# EAGLE design Shruthi-Digital-v02 (EAGLE 5.09)
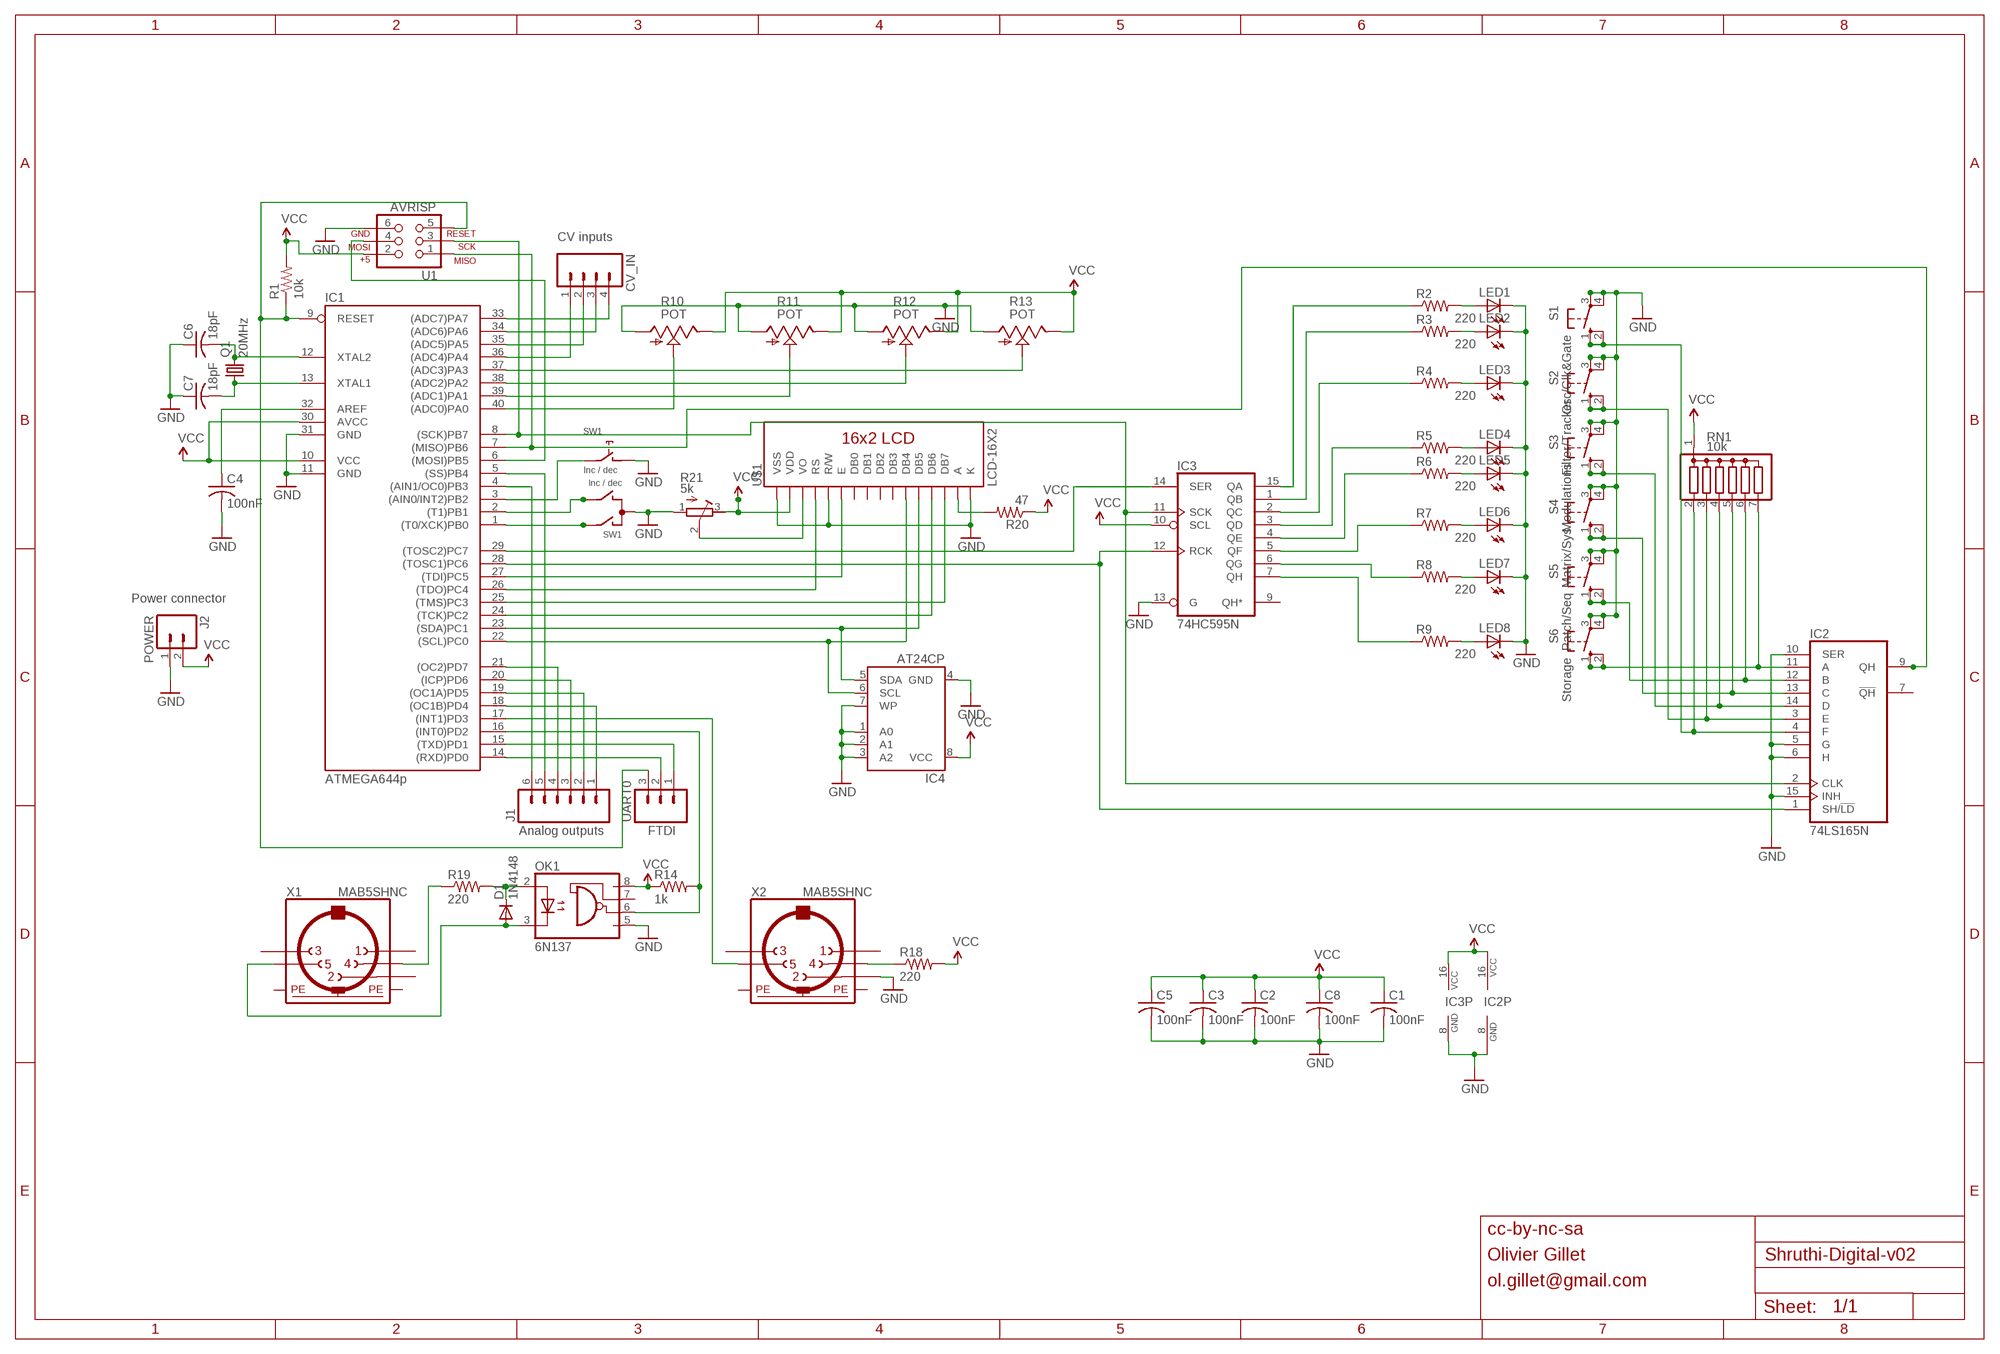
[diagram p0: schematic, sheet 1]

## Parts
C1  100nF  C-US025-024X044  [C025-024X044]
C2  100nF  C-US025-024X044  [C025-024X044]
C3  100nF  C-US025-024X044  [C025-024X044]
C4  100nF  C-US025-024X044  [C025-024X044]
C5  100nF  C-US025-024X044  [C025-024X044]
C6  18pF  C-US025-024X044  [C025-024X044]
C7  18pF  C-US025-024X044  [C025-024X044]
C8  100nF  C-US025-024X044  [C025-024X044]
CV_IN  M04PTH  [1X04]
D1  1N4148  DIODE-D-5  [D-5]
IC1  ATMEGA644p  MEGA16-P  [DIL40]
IC2  74LS165N  [DIL16]
IC3  74HC595N  [DIL16]
IC4  AT24CP  [DIL08]
J1  M06SIP  [1X06]
J2  POWER  M02PTH  [1X02]
LED1  LED3MM  [LED3MM]
LED2  LED3MM  [LED3MM]
LED3  LED3MM  [LED3MM]
LED4  LED3MM  [LED3MM]
LED5  LED3MM  [LED3MM]
LED6  LED3MM  [LED3MM]
LED7  LED3MM  [LED3MM]
LED8  LED3MM  [LED3MM]
OK1  6N137  [DIL08]
Q1  20MHz  CRYSTALHC49U-V  [HC49U-V]
R1  10k  R-US_0204/7  [0204/7]
R2  220  R-US_0204/7  [0204/7]
R3  220  R-US_0204/7  [0204/7]
R4  220  R-US_0204/7  [0204/7]
R5  220  R-US_0204/7  [0204/7]
R6  220  R-US_0204/7  [0204/7]
R7  220  R-US_0204/7  [0204/7]
R8  220  R-US_0204/7  [0204/7]
R9  220  R-US_0204/7  [0204/7]
R10  POT  POT_US  [ALPS_POT_SFE]
R11  POT  POT_US  [ALPS_POT_SFE]
R12  POT  POT_US  [ALPS_POT_SFE]
R13  POT  POT_US  [ALPS_POT_SFE]
R14  1k  R-US_0204/7  [0204/7]
R18  220  R-US_0204/7  [0204/7]
R19  220  R-US_0204/7  [0204/7]
R20  47  R-US_0204/7  [0204/7]
R21  5k  R-TRIMM3296W  [RTRIM3296W]
RN1  10k  G06R  [SIL7]
S1  Osc/Clk&Gate  40-XX  [B3F-40XX]
S2  Filter/Tracker  40-XX  [B3F-40XX]
S3  Modulations  40-XX  [B3F-40XX]
S4  Matrix/Sys  40-XX  [B3F-40XX]
S5  Patch/Seq  40-XX  [B3F-40XX]
S6  Storage  40-XX  [B3F-40XX]
SW1  Inc / dec  EC12E_SW  [ALPS_EC12E_SW]
U1  AVRISP  AVR_SPI_PRG_6PTH  [2X3]
U$1  LCD-16X2  [LCD-16X2]
UART0  M03PTH  [1X03]
X1  MAB5SHNC  [MAB5SH-NC]
X2  MAB5SHNC  [MAB5SH-NC]

## Nets
GND: C1.2 C2.2 C3.2 C4.2 C5.2 C6.1 C7.1 C8.2 IC1.11(GND) IC1.31(GND) IC2.5(G) IC2.6(H) IC2.8(GND) IC2.10(SER) IC2.15(INH) IC3.8(GND) IC3.13(G) IC4.1(A0) IC4.2(A1) IC4.3(A2) IC4.4(GND) IC4.7(WP) J2.1 LED1.K(C) LED2.K(C) LED3.K(C) LED4.K(C) LED5.K(C) LED6.K(C) LED7.K(C) LED8.K(C) OK1.5(GND) R10.P$3(A) R11.P$3(A) R12.P$3(A) R13.P$3(A) R21.1(E) S1.3(P) S1.4(P1) S2.3(P) S2.4(P1) S3.3(P) S3.4(P1) S4.3(P) S4.4(P1) S5.3(P) S5.4(P1) S6.3(P) S6.4(P1) SW1.C SW1.D U1.6 U$1.1(VSS) U$1.5(R/W) U$1.16(K) X2.2
N$1: IC3.2(QC) R4.1
N$2: IC1.14((RXD)PD0) UART0.2
N$3: IC2.11(A) RN1.7 S6.1(S) S6.2(S1)
N$5: IC2.3(E) RN1.3 S2.1(S) S2.2(S1)
N$6: IC1.9(RESET) R1.1 U1.5 UART0.3
N$7: C4.1 IC1.32(AREF)
N$8: IC1.8((SCK)PB7) IC2.2(CLK) IC3.11(SCK) U1.3
N$9: IC1.7((MISO)PB6) IC2.9(QH) U1.1
N$10: CV_IN.1 IC1.36((ADC4)PA4)
N$11: CV_IN.2 IC1.35((ADC5)PA5)
N$12: CV_IN.3 IC1.34((ADC6)PA6)
N$13: CV_IN.4 IC1.33((ADC7)PA7)
N$14: IC1.40((ADC0)PA0) R10.P$2(S)
N$15: IC1.39((ADC1)PA1) R11.P$2(S)
N$16: IC1.38((ADC2)PA2) R12.P$2(S)
N$17: IC1.37((ADC3)PA3) R13.P$2(S)
N$18: IC1.4((AIN1/OC0)PB3) J1.6
N$19: IC1.5((SS)PB4) J1.5
N$20: IC1.18((OC1B)PD4) J1.1
N$21: IC1.19((OC1A)PD5) J1.2
N$22: IC1.20((ICP)PD6) J1.3
N$23: IC1.21((OC2)PD7) J1.4
N$25: IC1.15((TXD)PD1) UART0.1
N$26: IC1.22((SCL)PC0) IC4.6(SCL) U$1.11(DB4)
N$27: IC1.26((TDO)PC4) U$1.4(RS)
N$28: D1.C OK1.2(A) R19.2
N$29: IC1.28((TOSC1)PC6) IC2.1(SH/!LD) IC3.12(RCK)
N$30: IC3.15(QA) R2.1
N$31: IC3.1(QB) R3.1
N$33: IC3.3(QD) R5.1
N$34: IC3.4(QE) R6.1
N$35: IC3.5(QF) R7.1
N$36: IC3.7(QH) R9.1
N$37: IC3.6(QG) R8.1
N$42: LED1.A R2.2
N$43: LED2.A R3.2
N$44: LED3.A R4.2
N$45: LED4.A R5.2
N$46: LED5.A R6.2
N$47: LED6.A R7.2
N$48: LED7.A R8.2
N$49: LED8.A R9.2
N$57: IC1.6((MOSI)PB5) U1.4
N$58: IC1.29((TOSC2)PC7) IC3.14(SER)
N$59: IC2.4(F) RN1.2 S1.1(S) S1.2(S1)
N$61: IC2.14(D) RN1.4 S3.1(S) S3.2(S1)
N$62: IC2.13(C) RN1.5 S4.1(S) S4.2(S1)
N$63: IC2.12(B) RN1.6 S5.1(S) S5.2(S1)
N$64: IC1.1((T0/XCK)PB0) SW1.A
N$65: IC1.2((T1)PB1) SW1.B
N$66: IC1.3((AIN0/INT2)PB2) SW1.E
N$68: R18.1 X2.4
N$69: IC1.17((INT1)PD3) X2.5
N$70: IC1.16((INT0)PD2) OK1.6(VO) R14.2
N$71: IC1.23((SDA)PC1) IC4.5(SDA) U$1.12(DB5)
N$72: R19.1 X1.4
N$73: D1.A OK1.3(C) X1.5
N$74: IC1.24((TCK)PC2) U$1.13(DB6)
N$75: IC1.25((TMS)PC3) U$1.14(DB7)
N$76: IC1.27((TDI)PC5) U$1.6(E)
N$78: R21.2(S) U$1.3(VO)
N$79: R20.2 U$1.15(A)
N$82: C7.2 IC1.13(XTAL1) Q1.1
N$83: C6.2 IC1.12(XTAL2) Q1.2
VCC: C1.1 C2.1 C3.1 C5.1 C8.1 IC1.10(VCC) IC1.30(AVCC) IC2.16(VCC) IC3.10(SCL) IC3.16(VCC) IC4.8(VCC) J2.2 OK1.8(VCC) R1.2 R10.P$1(E) R11.P$1(E) R12.P$1(E) R13.P$1(E) R14.1 R18.2 R20.1 R21.3(A) RN1.1 U1.2 U$1.2(VDD)
Unconnected: IC2.7(!QH) IC3.9(QH*) OK1.7(VE) SW1.GND1(G) SW1.GND2(G) U$1.7(DB0) U$1.8(DB1) U$1.9(DB2) U$1.10(DB3) X1.1 X1.2 X1.3 X2.1 X2.3

## Notes on the sheet
- CV inputs
- Power connector
- Analog outputs | FTDI
- cc-by-nc-sa
- Olivier Gillet
- ol.gillet@gmail.com

## Power pins joined to a net without a drawn wire
PE: X1.PE X1.PE@(PE) X2.PE X2.PE@(PE)

## Library data of the parts
C1-C8 = rcl:C-US: CAPACITOR, American symbol
CV_IN = SparkFun:M04: Header 4 Standard 4-pin 0.1" header. Use with straight break away headers (SKU : PRT-00116), right angle break away headers (PRT-00553), swiss pins (PRT-00743), machine pins (PRT-00117), and female headers (PRT-00115). Molex polarized connector foot print use with SKU : PRT-08231 with associated crimp pins and housings.
D1 = diode:DIODE-: DIODE
IC1 = atmel:MEGA16-P: MICROCONTROLLER 16 Kbytes FLASH 1 kbytes SRAM 512 bytes EEPROM USART 8-channel 10 bit ADC Source: avr.lbr
IC2 = 74xx-us:74*165: 8-bit parallel load SHIFT REGISTER
IC3 = 74xx-eu:74*595: 8-bit SHIFT REGISTER, output latch
IC4 = atmel:AT24C*: 2-wire serial EEPROM
J1 = SparkFun:M06: Header 6 Standard 6-pin 0.1" header. Use with straight break away headers (SKU : PRT-00116), right angle break away headers (PRT-00553), swiss pins (PRT-00743), machine pins (PRT-00117), and female headers (PRT-00115). Molex polarized connector foot print use with SKU : PRT-08094 with associated crimp pins and housings. NOTES ON THE VARIANTS LOCK and LOCK_LONGPADS... This footprint was designed to help hold the alignment of a through-hole component (i.e. 6-pin header) while soldering it into place. You may notice that each hole has been shifted either up or down by 0.005 of an inch from it's more standard position (which is a perfectly straight line). This slight alteration caused the pins (the squares in the middle) to touch the edges of the holes. Because they are alternating, it causes a "brace" to hold the component in place. 0.005 has proven to be the perfect amount of "off-center" position when using our standard breakaway headers. Although looks a little odd when you look at the bare footprint, once you have a header in there, the alteration is very hard to notice. Also, if you push a header all the way into place, it is covered up entirely on the bottom side. This idea of altering the position of holes to aid alignment will be further integrated into the Sparkfun Library for other footprints. It can help hold any component with 3 or more connection pins.
J2 = SparkFun:M02: Header 2 Standard 2-pin 0.1" header. Use with straight break away headers (SKU : PRT-00116), right angle break away headers (PRT-00553), swiss pins (PRT-00743), machine pins (PRT-00117), and female headers (PRT-00115). Molex polarized connector foot print use with SKU : PRT-08233 with associated crimp pins and housings.
LED1-LED8 = led:LED: LED OSRAM: - CHIPLED LG R971, LG N971, LY N971, LG Q971, LY Q971, LO R971, LY R971 LH N974, LH R974 LS Q976, LO Q976, LY Q976 LO Q996 - Hyper CHIPLED LW Q18S LB Q993, LB Q99A, LB R99A - SideLED LS A670, LO A670, LY A670, LG A670, LP A670 LB A673, LV A673, LT A673, LW A673 LH A674 LY A675 LS A676, LA A676, LO A676, LY A676, LW A676 LS A679, LY A679, LG A679 - Hyper Micro SIDELED® LS Y876, LA Y876, LO Y876, LY Y876 LT Y87S - SmartLED LW L88C, LW L88S LB L89C, LB L89S, LG L890 LS L89K, LO L89K, LY L89K LS L896, LA L896, LO L896, LY L896 - TOPLED LS T670, LO T670, LY T670, LG T670, LP T670 LSG T670, LSP T670, LSY T670, LOP T670, LYG T670 LG T671, LOG T671, LSG T671 LB T673, LV T673, LT T673, LW T673 LH T674 LS T676, LA T676, LO T676, LY T676, LB T676, LH T676, LSB T676, LW T676 LB T67C, LV T67C, LT T67C, LS T67K, LO T67K, LY T67K, LW E67C LS E67B, LA E67B, LO E67B, LY E67B, LB E67C, LV E67C, LT E67C LW T67C LS T679, LY T679, LG T679 LS T770, LO T770, LY T770, LG T770, LP T770 LB T773, LV T773, LT T773, LW T773 LH T774 LS E675, LA E675, LY E675, LS T675 LS T776, LA T776, LO T776, LY T776, LB T776 LHGB T686 LT T68C, LB T68C - Hyper Mini TOPLED® LB M676 - Mini TOPLED Santana® LG M470 LS M47K, LO M47K, LY M47K Source: http://www.osram.convergy.de LUXEON: - LUMILED® LXK2-PW12-R00, LXK2-PW12-S00, LXK2-PW14-U00, LXK2-PW14-V00 LXK2-PM12-R00, LXK2-PM12-S00, LXK2-PM14-U00 LXK2-PE12-Q00, LXK2-PE12-R00, LXK2-PE12-S00, LXK2-PE14-T00, LXK2-PE14-U00 LXK2-PB12-K00, LXK2-PB12-L00, LXK2-PB12-M00, LXK2-PB14-N00, LXK2-PB14-P00, LXK2-PB14-Q00 LXK2-PR12-L00, LXK2-PR12-M00, LXK2-PR14-Q00, LXK2-PR14-R00 LXK2-PD12-Q00, LXK2-PD12-R00, LXK2-PD12-S00 LXK2-PH12-R00, LXK2-PH12-S00 LXK2-PL12-P00, LXK2-PL12-Q00, LXK2-PL12-R00 Source: www.luxeon.com KINGBRIGHT: KA-3528ASYC Source: www.kingbright.com
OK1 = optocoupler:6N137: MOTOROLA OPTO COUPLER
Q1 = crystal:CRYSTAL: CRYSTAL
R1-R9 R14 R18-R20 = rcl:R-US_: RESISTOR, American symbol
R10-R13 = pot-alps:POT_US
R21 = rcl:R-TRIMM: Trimm resistor
RN1 = resistor-sil:G06R: SIL RESISTOR
S1-S6 = switch-omron:40-XX: OMRON SWITCH
SW1 = switch-alps:EC12E_SW: ALPS rotary Encoder EC12E series with switch
U1 = SparkFun:AVR_SPI_PRG_6: AVR ISP 6 Pin This is the reduced ISP connector for AVR programming. Common on Arduino. This footprint will take up less PCB space and can be used with a 10-pin to 6-pin adapter such as SKU: BOB-08508
U$1 = SparkFun:LCD-16X2
UART0 = SparkFun:M03: Header 3 Standard 3-pin 0.1" header. Use with straight break away headers (SKU : PRT-00116), right angle break away headers (PRT-00553), swiss pins (PRT-00743), machine pins (PRT-00117), and female headers (PRT-00115). Molex polarized connector foot print use with SKU : PRT-08232 with associated crimp pins and housings.
X1 X2 = con-hirschmann:MAB5SH: Female CONNECTOR 5 pins 90 deg. with shield, horizontal (DIN 41524)

## Board
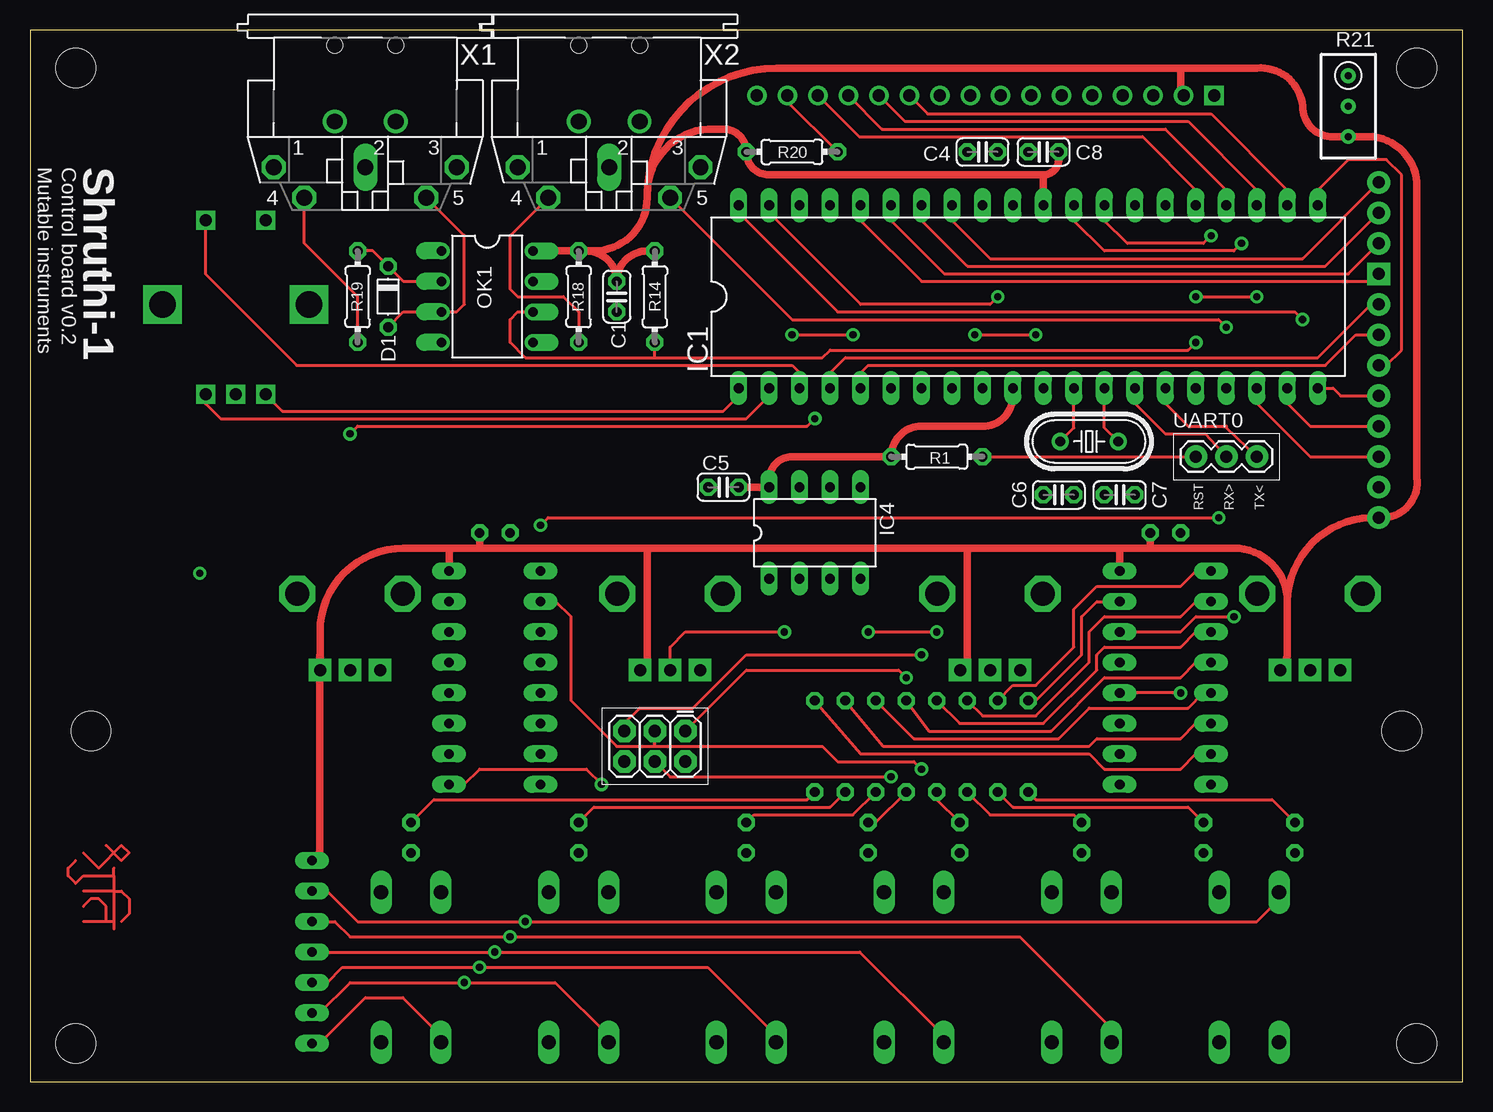
[diagram p1: board, top side]
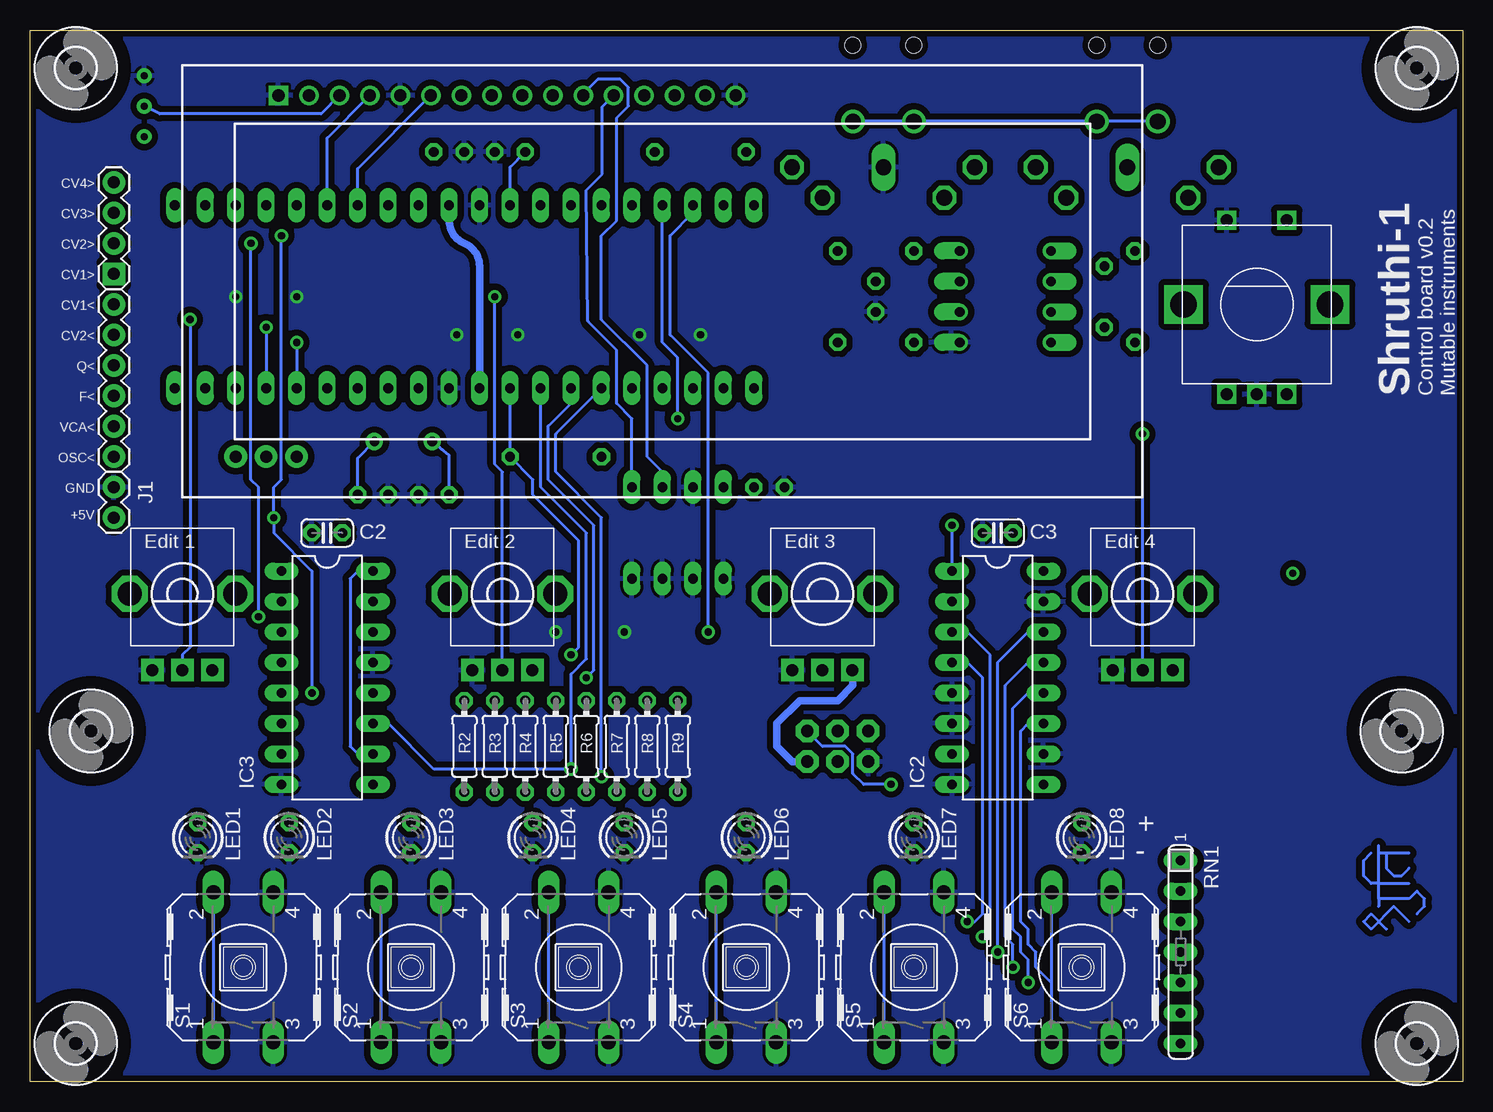
[diagram p2: board, bottom side, seen from below]

Size 119.38 x 87.63 mm. Coordinates in mm from the lower left corner, seen from the top.
Outline: 0,0 119.38,0 119.38,87.63 0,87.62 0,0
Copper layers (1*16): Top 0.035mm / dielectric 1.5mm / Bottom 0.035mm
Design rules "SparkFun": minimum track width 8mil, minimum drill 20mil, track to track 8mil, track to pad 8mil, pad to pad 8mil, via to via 8mil, smd to smd 8mil, copper to edge 10mil, drill to drill 8mil, minimum pad ring 12mil, minimum via ring 10mil, stop-mask expansion 4mil, vias tented up to drill 25mil, thermal gap 10mil

### Footprints (pad centres in the part's own frame; a part is rotated, then mirrored left to right if it is on the bottom)
C025-024X044 = drill 0.813 octagon: 1 -1.27,0; 2 1.27,0
1X04 = drill 1.016 pad 1.88 square: 1 0,0 | drill 1.016 pad 1.88 round: 2 2.54,0; 3 5.08,0; 4 7.62,0
D-5 = drill 0.813 octagon: A 2.54,0; C -2.54,0
DIL40 = drill 0.813 long: 1 -24.13,-7.62; 2 -21.59,-7.62; 3 -19.05,-7.62; 4 -16.51,-7.62; 5 -13.97,-7.62; 6 -11.43,-7.62; 7 -8.89,-7.62; 8 -6.35,-7.62; 9 -3.81,-7.62; 10 -1.27,-7.62; 11 1.27,-7.62; 12 3.81,-7.62; 13 6.35,-7.62; 14 8.89,-7.62; 15 11.43,-7.62; 16 13.97,-7.62; 17 16.51,-7.62; 18 19.05,-7.62; 19 21.59,-7.62; 20 24.13,-7.62; 21 24.13,7.62; 22 21.59,7.62; 23 19.05,7.62; 24 16.51,7.62; 25 13.97,7.62; 26 11.43,7.62; 27 8.89,7.62; 28 6.35,7.62; 29 3.81,7.62; 30 1.27,7.62; 31 -1.27,7.62; 32 -3.81,7.62; 33 -6.35,7.62; 34 -8.89,7.62; 35 -11.43,7.62; 36 -13.97,7.62; 37 -16.51,7.62; 38 -19.05,7.62; 39 -21.59,7.62; 40 -24.13,7.62
DIL16 = drill 0.813 long: 1 -8.89,-3.81; 2 -6.35,-3.81; 3 -3.81,-3.81; 4 -1.27,-3.81; 5 1.27,-3.81; 6 3.81,-3.81; 7 6.35,-3.81; 8 8.89,-3.81; 9 8.89,3.81; 10 6.35,3.81; 11 3.81,3.81; 12 1.27,3.81; 13 -1.27,3.81; 14 -3.81,3.81; 15 -6.35,3.81; 16 -8.89,3.81
DIL08 = drill 0.813 long: 1 -3.81,-3.81; 2 -1.27,-3.81; 3 1.27,-3.81; 4 3.81,-3.81; 5 3.81,3.81; 6 1.27,3.81; 7 -1.27,3.81; 8 -3.81,3.81
1X06 = drill 1.016 pad 1.88 round: 1 0,0; 2 2.54,0; 3 5.08,0; 4 7.62,0; 5 10.16,0; 6 12.7,0
1X02 = drill 1.016 pad 1.88 round: 1 0,0; 2 2.54,0
LED3MM = drill 0.813 octagon: A -1.27,0; K 1.27,0
DIL08' = drill 0.813 offset: 1 -3.81,-3.81; 2 -1.27,-3.81; 3 1.27,-3.81; 4 3.81,-3.81; 5 3.81,3.81; 6 1.27,3.81; 7 -1.27,3.81; 8 -3.81,3.81
HC49U-V = drill 0.813 round: 1 -2.413,0; 2 2.413,0
0204/7 = drill 0.813 octagon: 1 -3.81,0; 2 3.81,0
ALPS_POT_SFE = drill 1 pad 1.88 square: P$1 -2.5,6.35; P$2 0,6.35; P$3 2.5,6.35 | drill 2 octagon: P$4 -4.4,0; P$5 4.4,0
RTRIM3296W = drill 0.61 round: 1 0,-2.54; 2 0,0; 3 0,2.54
SIL7 = drill 0.813 long: 1 -7.62,0; 2 -5.08,0; 3 -2.54,0; 4 0,0; 5 2.54,0; 6 5.08,0; 7 7.62,0
B3F-40XX = drill 1.194 long: 1 -6.248,2.489; 2 6.248,2.489; 3 -6.248,-2.489; 4 6.248,-2.489
ALPS_EC12E_SW = drill 1 square: A -2.5,-7.5; B 2.5,-7.5; C 0,-7.5; D -2.5,7; E 2.5,7 | drill 2.2 square: GND1 -6.1,0; GND2 6.1,0
2X3 = drill 1.016 pad 1.88 octagon: 1 0,0; 2 0,2.54; 3 2.54,0; 4 2.54,2.54; 5 5.08,0; 6 5.08,2.54
LCD-16X2 = drill 1.016 square: 1 -32,15.5 | drill 1.016 round: 2 -29.46,15.5; 3 -26.92,15.5; 4 -24.38,15.5; 5 -21.84,15.5; 6 -19.3,15.5; 7 -16.76,15.5; 8 -14.22,15.5; 9 -11.68,15.5; 10 -9.14,15.5; 11 -6.6,15.5; 12 -4.06,15.5; 13 -1.52,15.5; 14 1.02,15.5; 15 3.56,15.5; 16 6.1,15.5
3,3 = hole 3.3: 0,0
1X03 = drill 1.016 pad 1.88 round: 1 0,0; 2 2.54,0; 3 5.08,0
MAB5SH-NC = drill 1.321 octagon: 1 7.62,7.62; 3 -7.62,7.62; 4 5.08,10.16; 5 -5.08,10.16 | drill 1.321 long: 2 0,7.62 | drill 1.321 round: PE -2.54,3.81; PE@ 2.54,3.81 | hole 1.321: -2.54,-2.54; 2.54,-2.54

### Placement (x,y rotation side)
C1  48.9,65.41 270 top
C2  94.61,45.72 180 bottom
C3  38.73,45.72 180 bottom
C4  79.38,77.47 0 top
C5  57.79,49.53 180 top
C6  85.73,48.89 180 top
C7  90.81,48.89 0 top
C8  84.45,77.47 180 top
CV_IN  112.39,67.31 90 bottom
D1  29.84,65.41 270 top
IC1  83.19,65.41 0 top
IC2  38.73,33.66 270 bottom
IC3  94.61,33.66 270 bottom
IC4  65.41,45.72 0 top
J1  112.39,52.07 90 bottom
J2  112.39,49.53 270 bottom
LED1  105.41,20.32 270 bottom
LED2  97.79,20.32 270 bottom
LED3  87.63,20.32 270 bottom
LED4  77.47,20.32 270 bottom
LED5  69.85,20.32 270 bottom
LED6  59.69,20.32 270 bottom
LED7  45.72,20.32 270 bottom
LED8  31.75,20.32 270 bottom
OK1  6N137  [DIL08']  38.1,65.41 270 top
Q1  88.27,53.34 180 top
R1  75.56,52.07 180 top
R2  83.19,27.94 270 bottom
R3  80.64,27.94 270 bottom
R4  78.11,27.94 270 bottom
R5  75.56,27.94 270 bottom
R6  73.02,27.94 270 bottom
R7  70.48,27.94 270 bottom
R8  67.94,27.94 270 bottom
R9  65.41,27.94 270 bottom
R10  106.68,40.64 180 bottom
R11  80.01,40.64 180 bottom
R12  53.34,40.64 180 bottom
R13  26.67,40.64 180 bottom
R14  52.07,65.41 270 top
R18  45.72,65.41 90 top
R19  27.3,65.41 90 top
R20  63.5,77.47 0 top
R21  109.86,81.28 180 top
RN1  23.49,10.8 270 bottom
S1  101.6,9.53 90 bottom
S2  87.63,9.53 90 bottom
S3  73.66,9.53 90 bottom
S4  59.69,9.53 90 bottom
S5  45.72,9.53 90 bottom
S6  31.75,9.53 90 bottom
SW1  17.14,64.77 0 bottom
U1  54.61,29.21 180 top
U$1  66.67,66.68 0 bottom
U$2  [3,3]  115.57,84.46 0 bottom
U$3  [3,3]  115.57,3.17 0 bottom
U$4  [3,3]  3.81,3.17 0 bottom
U$5  [3,3]  3.81,84.46 0 bottom
U$6  [3,3]  5.08,29.21 0 bottom
U$7  [3,3]  114.3,29.21 0 bottom
UART0  102.23,52.07 180 top
X1  27.94,83.82 180 top
X2  48.26,83.82 180 top

### Tracks (layer width: path | path; a pad name or v marks a point on that pad's centre or on a via)
GND  (via drill 0.6)
  Top 0.254: v97.16,65.41 v102.23,65.41 | v63.5,62.23 v68.58,62.23 | v78.74,62.23 v83.82,62.23 | v69.85,37.46 v75.56,37.46
  pour Bottom (isolate 0.508): 0.63,87 0.63,0.64 118.75,0.64 118.75,87
N$1
  Top 0.254: R4.1 79.38,30.48 83.82,30.48 88.27,34.92 88.27,37.46 89.53,38.73 95.89,38.73 97.16,40.01 IC3.2
N$2
  Top 0.254: IC1.14 92.08,56.52 94.61,53.98 97.92,53.98 UART0.2
N$3
  Top 0.254: S6.1 34.24,3.81 31.06,6.99 27.94,6.99 24.13,3.17 RN1.7
  Bottom 0.254: S6.1 34.24,8.25 | 34.24,8.25 S6.2 34.24,15.82 | IC2.11 36.2,29.84 36.83,29.21 36.83,13.34 36.2,12.7 36.2,11.43 35.56,10.8 35.56,9.53 34.29,8.25 34.24,8.25
N$4
  Top 0.254: 4.45,19.05 5.71,17.78 7.62,19.68 8.25,19.05 7.62,18.41 6.35,19.68
N$5  (via drill 0.6)
  Top 0.254: S2.1 90.12,4.45 82.5,12.07 v40.01,12.07 26.67,12.07 25.4,13.34 RN1.3
  Bottom 0.254: S2.1 S2.2 | IC2.3 41.27,37.46 39.37,35.56 39.37,12.7 v40.01,12.07
N$6  (via drill 0.6)
  Top 0.254: R1.1 96.52,52.07 96.65,51.94 UART0.3 | v74.3,35.56 59.69,35.56 55.25,31.11 50.8,31.11 49.53,29.84 U1.5
  Bottom 0.254: IC1.9 R1.1 77.47,50.16 77.47,48.89 73.66,45.09 73.66,36.2 v74.3,35.56
N$7
  Bottom 0.254: IC1.32 79.38,76.2 C4.1
N$8  (via drill 0.6)
  Top 0.254: v74.3,26.04 73.66,26.67 67.31,26.67 66.04,27.94 52.07,27.94 | 52.07,27.94 48.9,27.94 45.09,31.75 45.09,38.73 43.82,40.01 IC2.2 | 52.07,27.94 U1.3
  Bottom 0.254: IC1.8 76.84,49.53 73.02,45.72 73.02,35.23 74.3,33.96 v74.3,26.04 85.73,26.04 89.53,29.84 IC3.11
N$9  (via drill 0.6)
  Top 0.254: v73.02,33.66 72.39,34.29 59.69,34.29 U1.1 | v47.62,24.77 46.36,26.04 37.47,26.04 36.2,24.77 IC2.9
  Bottom 0.254: IC1.7 74.3,56.52 76.2,54.61 76.2,50.16 72.39,46.35 72.39,34.29 v73.02,33.66 | U1.1 53.34,27.94 51.44,27.94 50.8,27.3 50.8,25.66 49.9,24.77 v47.62,24.77
N$10
  Top 0.254: IC1.36 69.22,71.76 74.3,66.68 111.76,66.68 CV_IN.1
N$11
  Top 0.254: IC1.35 71.75,71.76 76.2,67.31 109.86,67.31 CV_IN.2
N$12
  Top 0.254: IC1.34 74.3,71.76 78.11,67.95 107.95,67.95 CV_IN.3
N$13
  Top 0.254: IC1.33 76.84,71.76 80.01,68.58 106.05,68.58 CV_IN.4
N$14  (via drill 0.6)
  Top 0.254: IC1.40 59.05,72.39 67.31,64.14 105.41,64.14 v106.05,63.5
  Bottom 0.254: v106.05,63.5 106.05,36.2 106.68,35.56 R10.P$2
N$15  (via drill 0.6)
  Top 0.254: IC1.39 61.59,72.39 69.22,64.77 80.01,64.77 v80.64,65.41
  Bottom 0.254: v80.64,65.41 80.64,51.44 80.01,50.8 R11.P$2
N$16  (via drill 0.6)
  Top 0.254: R12.P$2 53.34,36.2 54.61,37.46 v62.87,37.46
  Bottom 0.254: IC1.38 64.14,72.39 66.04,70.48 66.04,62.23 62.87,59.05 v62.87,37.46
N$17  (via drill 0.6)
  Top 0.254: v26.67,53.98 27.3,54.61 64.77,54.61 v65.41,55.24
  Bottom 0.254: R13.P$2 v26.67,53.98 | IC1.37 66.67,61.59 65.41,60.32 v65.41,55.24
N$18
  Top 0.254: IC1.4 66.67,59.05 67.94,60.32 107.31,60.32 111.76,64.77 J1.6
N$19
  Top 0.254: IC1.5 69.22,59.05 69.85,59.69 107.95,59.69 110.49,62.23 J1.5
N$20
  Top 0.254: IC1.18 102.23,56.52 106.68,52.07 J1.1
N$21
  Top 0.254: IC1.19 104.78,56.52 106.68,54.61 J1.2
N$22
  Top 0.254: IC1.20 108.59,57.78 109.22,57.15 J1.3
N$23
  Top 0.254: IC1.21 107.31,74.3 109.86,76.84 113.03,76.84 114.3,75.57 114.3,60.96 113.03,59.69 J1.4
N$24  (via drill 0.6)
  other vias: 14.15,42.37
N$25
  Top 0.254: IC1.15 94.61,56.52 96.52,54.61 99.7,54.61 99.7,54.48 UART0.1
N$26
  Top 0.254: U$1.11 74.81,80.65 98.42,80.65 104.78,74.3 IC1.22
  Bottom 0.254: U$1.11 73.27,82.3 72.06,83.52 70.18,83.52 69.52,82.86 69.52,81.28 70.48,80.32 70.48,71.76 71.75,70.48 71.75,63.5 67.94,59.69 67.94,52.07 66.67,50.8 IC4.6
N$27
  Bottom 0.254: U$1.4 94.61,78.62 IC1.26
N$28
  Top 0.254: OK1.2 31.12,66.68 D1.C 28.58,69.22 R19.2
N$29  (via drill 0.6)
  Top 0.254: IC1.28 89.53,71.76 91.44,69.85 97.79,69.85 v98.42,70.48 | v42.55,46.35 43.18,46.99 v99.06,46.99 | v95.89,32.38 IC3.12
  Bottom 0.254: v98.42,70.48 98.42,50.16 99.06,49.53 v99.06,46.99 99.06,45.72 95.89,42.55 v95.89,32.38 | IC2.1 v42.55,46.35
N$30
  Top 0.254: R2.1 83.82,31.75 87.63,35.56 87.63,38.73 88.9,40.01 IC3.15
N$31
  Top 0.254: R3.1 81.92,33.02 83.82,33.02 87,36.2 87,39.37 88.9,41.27 95.89,41.27 97.16,42.55 IC3.1
N$33
  Top 0.254: R5.1 77.47,29.84 84.45,29.84 88.9,34.29 88.9,35.56 89.53,36.2 95.89,36.2 97.16,37.46 IC3.3
N$34
  Top 0.254: R6.1 74.93,29.21 85.09,29.21 89.53,33.66 95.89,33.66 97.16,34.92 IC3.4
N$35
  Top 0.254: R7.1 73.66,28.57 85.73,28.57 88.27,31.11 96.52,31.11 97.79,32.38 IC3.5
N$36
  Top 0.254: R9.1 69.22,27.3 88.27,27.3 89.53,26.04 95.89,26.04 97.16,27.3 IC3.7
N$37
  Top 0.254: R8.1 71.12,27.94 88.27,27.94 88.9,28.57 95.89,28.57 97.16,29.84 IC3.6
N$42
  Top 0.254: R2.2 83.82,23.49 103.5,23.49 LED1.A
N$43
  Top 0.254: R3.2 81.92,22.86 96.52,22.86 LED2.A
N$44
  Top 0.254: R4.2 80.01,22.22 87,22.22 LED3.A
N$45
  Top 0.254: LED4.A 75.56,23.49 R5.2
N$46
  Top 0.254: LED5.A 70.48,21.59 R6.2
N$47
  Top 0.254: R7.2 68.58,22.22 60.33,22.22 LED6.A
N$48
  Top 0.254: R8.2 66.67,22.86 46.99,22.86 LED7.A
N$49
  Top 0.254: R9.2 64.77,23.49 33.66,23.49 LED8.A
N$52
  Top 0.254: 6.98,17.14 6.98,17.78 | 6.98,17.14 6.98,15.88 | 6.98,15.88 6.98,13.34 | 6.98,13.34 6.98,12.7 | 6.35,13.34 4.45,13.34 | 6.98,13.34 6.35,13.34 | 6.35,13.34 6.35,14.61 5.71,15.24 5.08,15.24 4.45,14.61 | 6.98,17.14 4.45,17.14 3.81,16.51 3.17,17.14 3.17,17.78 3.81,18.41 | 6.98,15.88 4.45,15.88 | 6.98,15.88 7.62,15.88 8.25,15.24 8.25,13.97 7.62,13.34
N$53
  Bottom 0.254: 4.45,13.34 5.71,14.61 7.62,12.7 8.25,13.34 7.62,13.97 6.35,12.7
N$54
  Bottom 0.254: 6.98,15.24 6.98,14.61 | 6.98,15.24 6.98,16.51 | 6.98,16.51 6.98,19.05 | 6.98,19.05 6.98,19.68 | 6.35,19.05 4.45,19.05 | 6.98,19.05 6.35,19.05 | 6.35,19.05 6.35,17.78 5.71,17.14 5.08,17.14 4.45,17.78 | 6.98,15.24 4.45,15.24 3.81,15.88 3.17,15.24 3.17,14.61 3.81,13.97 | 6.98,16.51 4.45,16.51 | 6.98,16.51 7.62,16.51 8.25,17.14 8.25,18.41 7.62,19.05
N$57  (via drill 0.6)
  Top 0.254: U1.4 53.34,25.4 v71.75,25.4
  Bottom 0.254: IC1.6 75.56,53.98 75.56,50.8 71.75,46.99 v71.75,25.4
N$58  (via drill 0.6)
  Top 0.254: v100.97,69.85 100.33,69.22 89.53,69.22 87,71.76 IC1.29 | IC3.14 95.89,37.46 97.16,38.73 v100.33,38.73
  Bottom 0.254: v100.33,38.73 100.33,49.53 100.97,50.16 v100.97,69.85
N$59  (via drill 0.6)
  Top 0.254: S1.2 104.09,15.29 104.14,15.24 102.23,13.34 v41.27,13.34 27.3,13.34 24.77,15.88 RN1.2
  Bottom 0.254: S1.2 S1.1 | IC2.4 41.27,34.92 40.01,33.66 40.01,13.97 40.64,13.34 v41.27,13.34
N$61  (via drill 0.6)
  Top 0.254: S3.1 76.15,3.81 69.16,10.8 v38.73,10.8 RN1.4
  Bottom 0.254: S3.1 S3.2 | IC2.14 36.2,37.46 38.73,34.92 v38.73,10.8
N$62  (via drill 0.6)
  Top 0.254: S4.1 62.18,3.81 56.46,9.53 v37.47,9.53 26.04,9.53 24.77,8.25 RN1.5
  Bottom 0.254: S4.1 S4.2 | IC2.13 36.2,34.92 38.1,33.02 38.1,12.07 37.47,11.43 v37.47,9.53
N$63  (via drill 0.6)
  Top 0.254: S5.1 48.21,3.81 43.76,8.25 v36.2,8.25 26.67,8.25 24.13,5.71 RN1.6
  Bottom 0.254: S5.1 S5.2 | IC2.12 36.2,32.38 37.47,31.11 37.47,12.7 36.83,12.07 36.83,10.8 36.2,10.16 v36.2,8.25
N$64
  Top 0.254: SW1.A 21.04,55.88 57.79,55.88 59.05,57.15 IC1.1
N$65
  Top 0.254: IC1.2 61.59,57.15 59.69,55.24 15.88,55.24 14.64,56.48 SW1.B
N$66
  Top 0.254: IC1.3 64.14,59.05 63.5,59.69 22.23,59.69 14.61,67.31 14.64,67.35 SW1.E
N$68
  Top 0.254: R18.1 45.72,64.14 44.45,65.41 40.64,65.41 40.01,66.04 40.01,70.48 X2.4
N$69  (via drill 0.6)
  Top 0.254: X2.5 63.5,63.5 99.06,63.5 v99.7,62.87
  Bottom 0.254: v99.7,62.87 IC1.17
N$70  (via drill 0.6)
  Top 0.254: v97.16,61.59 96.52,60.96 66.67,60.96 66.04,60.32 52.07,60.32 | 52.07,60.32 41.27,60.32 40.01,61.59 40.01,63.5 40.64,64.14 OK1.6 | 52.07,60.32 R14.2
  Bottom 0.254: v97.16,61.59 IC1.16
N$71
  Top 0.254: U$1.12 72.9,80.01 96.52,80.01 102.23,74.3 IC1.23
  Bottom 0.254: IC4.5 69.22,55.24 70.48,56.52 70.48,60.96 72.9,63.38 73.02,74.3 71.69,75.63 71.69,81.22 U$1.12
N$72
  Top 0.254: X1.4 22.86,69.85 27.3,65.41 R19.1
N$73
  Top 0.254: X1.5 36.2,70.48 36.2,64.77 35.56,64.14 OK1.3 31.12,64.14 D1.A
N$74
  Top 0.254: U$1.13 71,79.38 94.61,79.38 99.7,74.3 IC1.24
N$75
  Top 0.254: IC1.25 97.16,74.3 92.71,78.74 69.09,78.74 U$1.14
N$76
  Bottom 0.254: U$1.6 92.08,76.08 IC1.27
N$78
  Bottom 0.254: U$1.3 95.12,80.65 108.59,80.65 R21.2
N$79
  Top 0.254: R20.2 63.12,81.67 U$1.15
N$82
  Top 0.254: IC1.13 89.53,54.48 Q1.1
  Bottom 0.254: Q1.1 92.08,51.94 C7.2
N$83
  Top 0.254: IC1.12 87,54.48 Q1.2
  Bottom 0.254: C6.2 84.45,52.2 Q1.2
PE
  Bottom 0.254: X1.PE@ X1.PE X2.PE@ X2.PE
VCC
  Top 0.61: OK1.8 R18.2 46.36,69.22 | 51.44,44.45 78.11,44.45 | R11.P$1 78.11,34.88 78.11,44.45 | R12.P$1 51.44,34.88 51.44,44.45 | 78.11,44.45 90.81,44.45 | IC1.10 81.92,57.15 arc-90 79.38,54.61 74.3,54.61 arc90 R1.2 63.5,52.07 arc90 61.59,50.16 IC4.8 C5.1 | 51.44,73.66 arc-90 62.23,84.46 95.89,84.46 | 51.44,73.66 arc-90 46.99,69.22 46.36,69.22 | 46.36,69.22 arc-90 C1.1 arc-90 51.44,69.22 R14.1 | 51.44,73.66 arc-90 56.52,79.38 57.79,79.38 arc-90 R20.1 arc90 61.59,75.57 84.45,75.57 | 84.45,75.57 IC1.30 | 34.92,44.45 31.12,44.45 arc90 24.17,37.51 R13.P$1 24.13,35.52 24.13,19.05 RN1.1 | 34.92,44.45 37.47,44.45 | 37.47,44.45 51.44,44.45 | 34.92,44.45 IC2.16 | 90.81,44.45 IC3.16 | 95.89,84.46 102.23,84.46 arc-90 106.05,81.28 arc90 108.59,78.74 R21.3 111.12,78.74 arc-90 115.57,74.93 115.57,50.3 arc-102 J2.2 arc92 104.78,40.01 | U$1.2 95.89,82.18 95.89,84.46 | 90.81,44.45 93.34,44.45 | 93.34,44.45 C2.1 | 104.78,40.01 104.78,35.52 arc-35 R10.P$1 | 93.34,44.45 100.33,44.45 arc-90 104.78,40.01 | 37.47,44.45 C3.1 | 84.45,75.57 arc90 85.73,76.84 C8.1
  Bottom 0.254: IC3.10 92.08,27.3 92.71,27.94 92.71,41.91 92.08,42.55 IC3.16
  Bottom 0.61: U1.2 55.88,26.67 57.15,27.94 57.15,29.84 55.25,31.75 52.07,31.75 50.8,33.02 50.8,34.25 R12.P$1 | IC1.10 81.92,67.95 arc-67 83.19,69.85 arc67 84.45,71.76 IC1.30

### Text on the board
tPlace: RST | RX> | TX<
bPlace: CV4> | CV3> | CV2> | CV1> | CV1< | CV2< | Q< | F< | VCA< | OSC< | GND | +5V | Edit 4 | Edit 3 | Edit 2 | Edit 1 | + | -
tNames: Mutable instruments | Control board v0.2 | Shruthi-1
bNames: Mutable instruments | Control board v0.2 | Shruthi-1